# Altium schematic sheet Flash Memory.SchDoc
size B; Organization: Pyrotechnics Management Inc.; DocumentNumber: 11; SheetNumber: 11; SheetTotal: 14; PageSetup: Record=PageOptions|CenterHorizontal=True|CenterVertical=True|PrintScale=0.99|XCorrection=1.00|YCorrection=1.00|PrintKind=1|BorderSize=5000000|LeftOffset=0|BottomOffset=0|Orientation=2|PaperLength=1000|PaperWidth=1000|Scale=100|PaperSource=7|PrintQuality=-4|MediaType=1|DitherType=10|PaperKind=Tabloid (11 x 17")|PrintScaleMode=1; SCHEMATIC_SHEET_TITLE: FLASH MEMORY; PAGE_TITLE: -
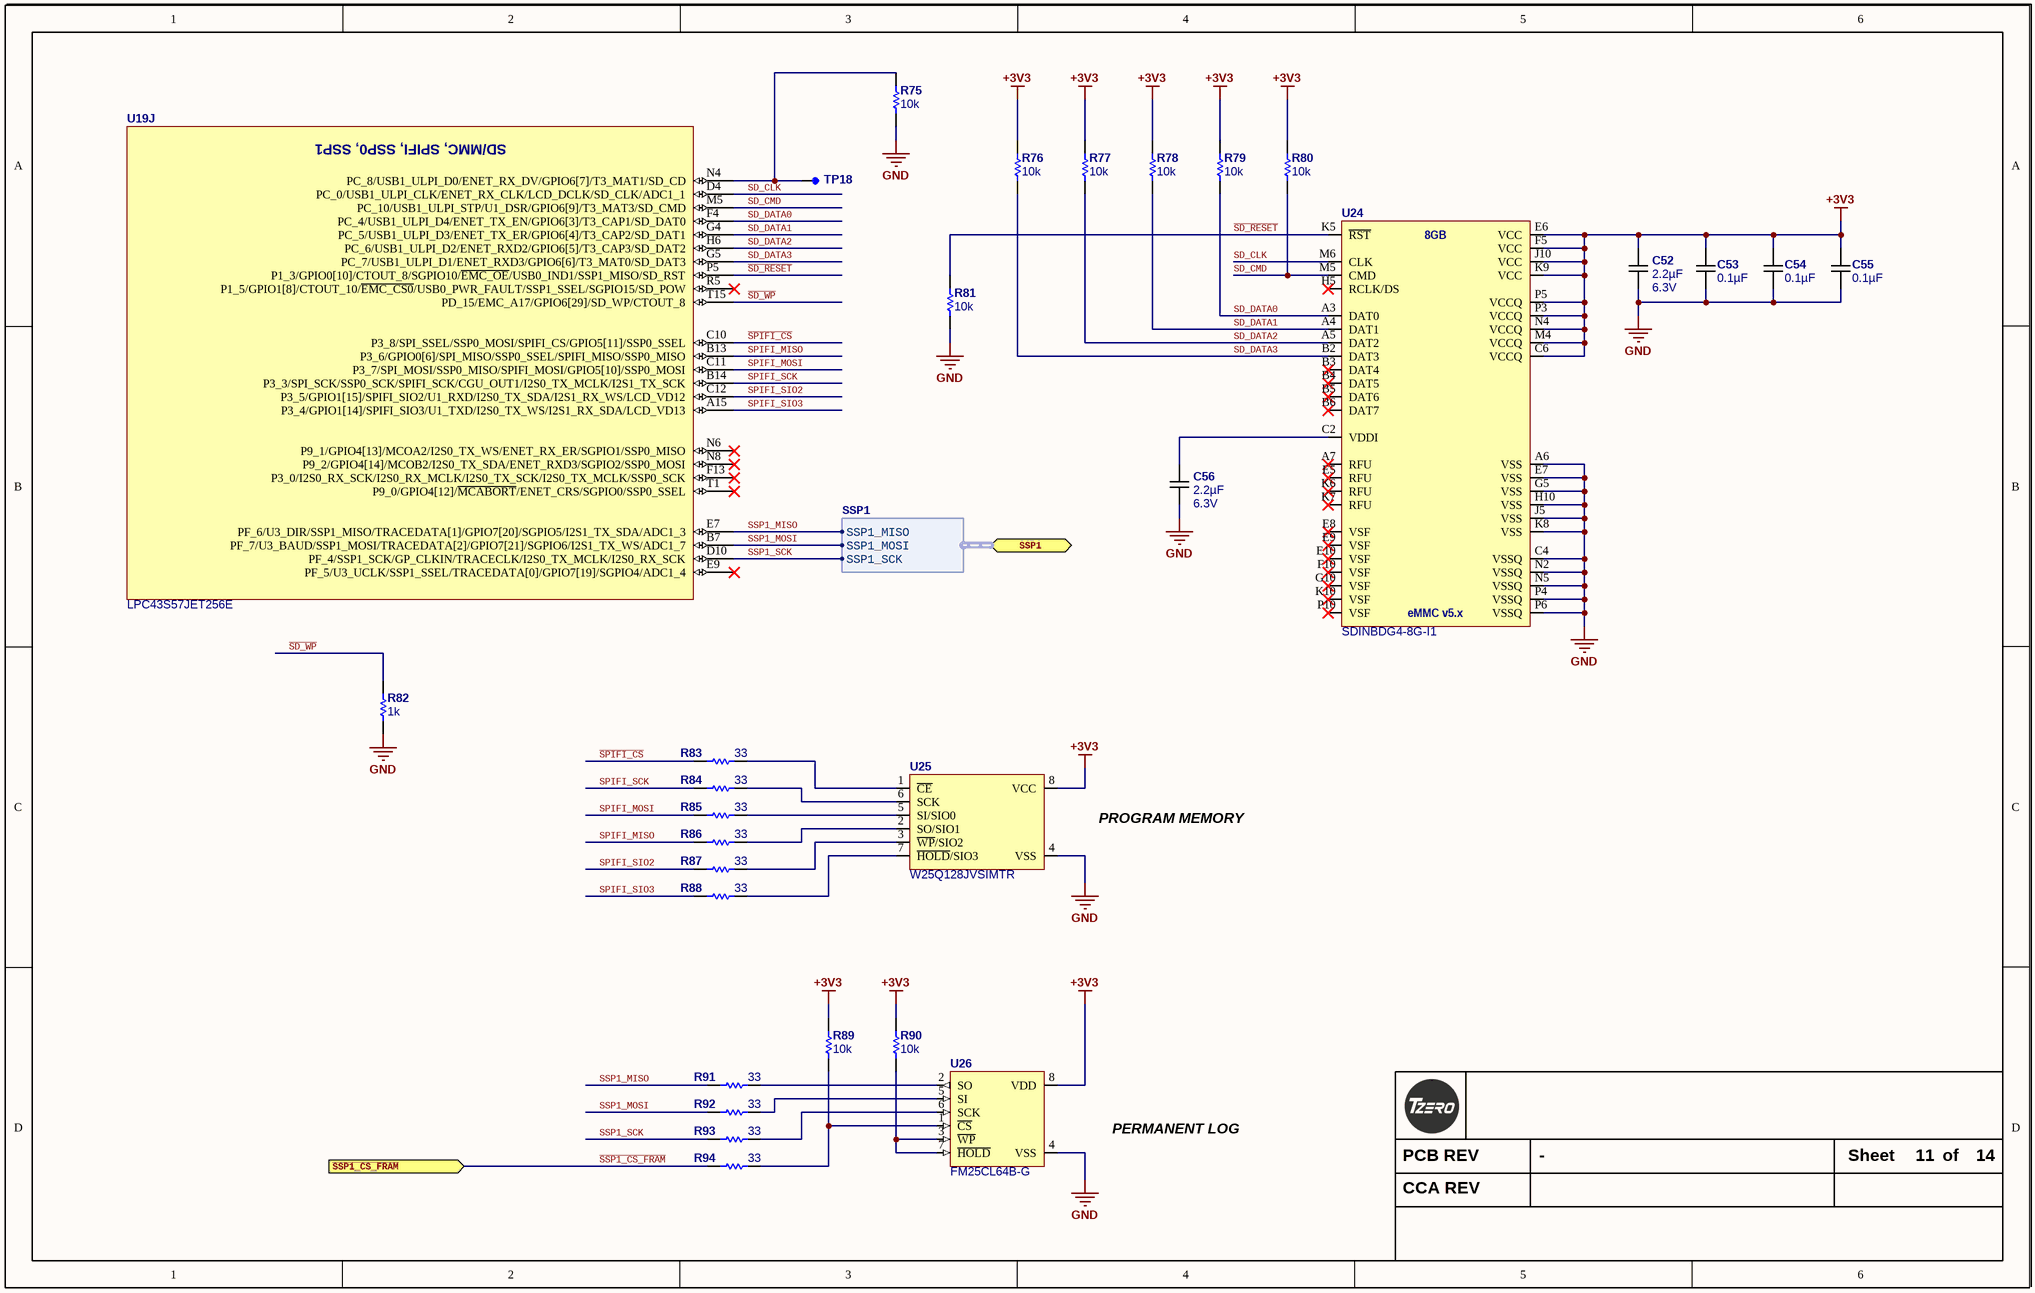
[diagram p0: Flash Memory.SchDoc]

## Parts
C52  2.2µF  Voltage - Rated: 6.3V  [C0603_0.90MM_HD]
C53  0.1µF  [C0402_0.55MM_HD]
C54  0.1µF  [C0402_0.55MM_HD]
C55  0.1µF  [C0402_0.55MM_HD]
C56  2.2µF  Voltage - Rated: 6.3V  [C0603_0.90MM_HD]
R75  10k  [R0603_0.55MM_MD]
R76  10k  [R0603_0.55MM_MD]
R77  10k  [R0603_0.55MM_MD]
R78  10k  [R0603_0.55MM_MD]
R79  10k  [R0603_0.55MM_MD]
R80  10k  [R0603_0.55MM_MD]
R81  10k  [R0603_0.55MM_MD]
R82  1k  [R0603_0.55MM_MD]
R83  33  [R0603_0.55MM_MD]
R84  33  [R0603_0.55MM_MD]
R85  33  [R0603_0.55MM_MD]
R86  33  [R0603_0.55MM_MD]
R87  33  [R0603_0.55MM_MD]
R88  33  [R0603_0.55MM_MD]
R89  10k  [R0603_0.55MM_MD]
R90  10k  [R0603_0.55MM_MD]
R91  33  [R0603_0.55MM_MD]
R92  33  [R0603_0.55MM_MD]
R93  33  [R0603_0.55MM_MD]
R94  33  [R0603_0.55MM_MD]
TP18  (no value)  [TP_SMT_25_MIL_ROUND]  (net tie, no BOM)
U19  LPC43S57JET256E  [LBGA256 16X16 1700X1700X155]  (part J of 10)
U24  SDINBDG4-8G-I1  [BGA_JDEC_EMMC_11.5x13.1x1.1_153PIN]
U25  W25Q128JVSIMTR  [SOIC-8W]
U26  FM25CL64B-G  [SOIC-8]

## Ports
SSP1 (bidir, harness SSP1), ~{SSP1_CS_FRAM} (in)

## Harnesses
SSP1: SSP1_MISO, SSP1_MOSI, SSP1_SCK

## Nets
+3V3: C52.2 C53.2 C54.2 C55.2 R76.2 R77.2 R78.2 R79.2 R80.2 R89.1 R90.2 U24.C6(VCCQ) U24.E6(VCC) U24.F5(VCC) U24.J10(VCC) U24.K9(VCC) U24.M4(VCCQ) U24.N4(VCCQ) U24.P3(VCCQ) U24.P5(VCCQ) U25.8(VCC) U26.8(VDD)
GND: C52.1 C53.1 C54.1 C55.1 C56.1 R75.1 R81.1 R82.1 U24.A6(VSS) U24.C4(VSSQ) U24.E7(VSS) U24.G5(VSS) U24.H10(VSS) U24.J5(VSS) U24.K8(VSS) U24.N2(VSSQ) U24.N5(VSSQ) U24.P4(VSSQ) U24.P6(VSSQ) U25.4(VSS) U26.4(VSS)
~{SD_RESET}: R81.2 U19.P5(P1_3/GPIO0[10]/CTOUT_8/SGPIO10/~{EMC_OE}/USB0_IND1/SSP1_MISO/SD_RST) U24.K5(~{RST})
~{SD_WP}: R82.2 U19.T15(PD_15/EMC_A17/GPIO6[29]/SD_WP/CTOUT_8)
~{SPIFI_CS}: R83.2 U19.C10(P3_8/SPI_SSEL/SSP0_MOSI/SPIFI_CS/GPIO5[11]/SSP0_SSEL)
~{SSP1_CS_FRAM}: R94.2 ; port ~{SSP1_CS_FRAM}
SD_CLK: U19.D4(PC_0/USB1_ULPI_CLK/ENET_RX_CLK/LCD_DCLK/SD_CLK/ADC1_1) U24.M6(CLK)
SD_CMD: R80.1 U19.M5(PC_10/USB1_ULPI_STP/U1_DSR/GPIO6[9]/T3_MAT3/SD_CMD) U24.M5(CMD)
SD_DATA0: R79.1 U19.F4(PC_4/USB1_ULPI_D4/ENET_TX_EN/GPIO6[3]/T3_CAP1/SD_DAT0) U24.A3(DAT0)
SD_DATA1: R78.1 U19.G4(PC_5/USB1_ULPI_D3/ENET_TX_ER/GPIO6[4]/T3_CAP2/SD_DAT1) U24.A4(DAT1)
SD_DATA2: R77.1 U19.H6(PC_6/USB1_ULPI_D2/ENET_RXD2/GPIO6[5]/T3_CAP3/SD_DAT2) U24.A5(DAT2)
SD_DATA3: R76.1 U19.G5(PC_7/USB1_ULPI_D1/ENET_RXD3/GPIO6[6]/T3_MAT0/SD_DAT3) U24.B2(DAT3)
SPIFI_MISO: R86.2 U19.B13(P3_6/GPIO0[6]/SPI_MISO/SSP0_SSEL/SPIFI_MISO/SSP0_MISO)
SPIFI_MOSI: R85.2 U19.C11(P3_7/SPI_MOSI/SSP0_MISO/SPIFI_MOSI/GPIO5[10]/SSP0_MOSI)
SPIFI_SCK: R84.2 U19.B14(P3_3/SPI_SCK/SSP0_SCK/SPIFI_SCK/CGU_OUT1/I2S0_TX_MCLK/I2S1_TX_SCK)
SPIFI_SIO2: R87.2 U19.C12(P3_5/GPIO1[15]/SPIFI_SIO2/U1_RXD/I2S0_TX_SDA/I2S1_RX_WS/LCD_VD12)
SPIFI_SIO3: R88.2 U19.A15(P3_4/GPIO1[14]/SPIFI_SIO3/U1_TXD/I2S0_TX_WS/I2S1_RX_SDA/LCD_VD13)
SSP1_MISO: R91.2 U19.E7(PF_6/U3_DIR/SSP1_MISO/TRACEDATA[1]/GPIO7[20]/SGPIO5/I2S1_TX_SDA/ADC1_3) ; port SSP1.SSP1_MISO
SSP1_MOSI: R92.2 U19.B7(PF_7/U3_BAUD/SSP1_MOSI/TRACEDATA[2]/GPIO7[21]/SGPIO6/I2S1_TX_WS/ADC1_7) ; port SSP1.SSP1_MOSI
SSP1_SCK: R93.2 U19.D10(PF_4/SSP1_SCK/GP_CLKIN/TRACECLK/I2S0_TX_MCLK/I2S0_RX_SCK) ; port SSP1.SSP1_SCK
NetC56_2: C56.2 U24.C2(VDDI)
NetR75_2: R75.2 TP18.1 U19.N4(PC_8/USB1_ULPI_D0/ENET_RX_DV/GPIO6[7]/T3_MAT1/SD_CD)
NetR83_1: R83.1 U25.1(~{CE})
NetR84_1: R84.1 U25.6(SCK)
NetR85_1: R85.1 U25.5(SI/SIO0)
NetR86_1: R86.1 U25.2(SO/SIO1)
NetR87_1: R87.1 U25.3(~{WP}/SIO2)
NetR88_1: R88.1 U25.7(~{HOLD}/SIO3)
NetR89_2: R89.2 R94.1 U26.1(~{CS})
NetR90_1: R90.1 U26.3(~{WP}) U26.7(~{HOLD})
NetR91_1: R91.1 U26.2(SO)
NetR92_1: R92.1 U26.5(SI)
NetR93_1: R93.1 U26.6(SCK)

Not connected (* = marked no-connect by the designer): U19 E9(PF_5/U3_UCLK/SSP1_SSEL/TRACEDATA[0]/GPIO7[19]/SGPIO4/ADC1_4)* F13(P3_0/I2S0_RX_SCK/I2S0_RX_MCLK/I2S0_TX_SCK/I2S0_TX_MCLK/SSP0_SCK)* N6(P9_1/GPIO4[13]/MCOA2/I2S0_TX_WS/ENET_RX_ER/SGPIO1/SSP0_MISO)* N8(P9_2/GPIO4[14]/MCOB2/I2S0_TX_SDA/ENET_RXD3/SGPIO2/SSP0_MOSI)* R5(P1_5/GPIO1[8]/CTOUT_10/~{EMC_CS0}/USB0_PWR_FAULT/SSP1_SSEL/SGPIO15/SD_POW)* T1(P9_0/GPIO4[12]/~{MCABORT}/ENET_CRS/SGPIO0/SSP0_SSEL)*; U24 A7(RFU)* B3(DAT4)* B4(DAT5)* B5(DAT6)* B6(DAT7)* E5(RFU)* E8(VSF)* E9(VSF)* E10(VSF)* F10(VSF)* G10(VSF)* H5(RCLK/DS)* K6(RFU)* K7(RFU)* K10(VSF)* P10(VSF)*

## Notes on the sheet
- PROGRAM MEMORY
- PERMANENT LOG
- PCB REV
- Sheet
- of
- CCA REV
- (in symbol LPC43S57JET256E, part J) SD/MMC, SPIFI, SSP0, SSP1
- (in symbol SDINBDG4-8G-I1) 8GB; eMMC v5.x

## Library data of the parts
C52 C56 = CGA3E1X7R0J225M080AC: CAP CER 2.2UF 6.3V X7R 0603; Manufacturer: TDK Corporation; Tolerance: ±20%; Substitution Notes: 2.2µF , 6.3V , ±20% , X7R , -55°C ~ 125°C , AEC-Q200 , 0603; Value: 2.2µF; Temperature Coefficient: X7R; Manufacturer Part Number: CGA3E1X7R0J225M080AC; ComponentLink1Description: Datasheet (Internal); ComponentLink1URL: datasheets\TDK\mlcc_automotive_general_en.pdf; ComponentLink2Description: Datasheet (External); ComponentLink2URL: https://product.tdk.com/info/en/catalog/datasheets/mlcc_automotive_general_en.pdf; Supplier 1: Digikey; Supplier Part Number 1: 445-12572-1-ND; Category: Capacitors; Operating Temperature: -55°C ~ 125°C; Ratings: AEC-Q200; Package: 0603; Thickness (Max): 0.90MM; Features: -
C53-C55 = CGA2B3X7R1E104K050BB: CAP CER 0.1UF 25V X7R 0402; Manufacturer: TDK Corporation; Tolerance: ±10%; Substitution Notes: 0.1µF , 25V , ±10% , X7R , -55°C ~ 125°C , AEC-Q200 , 0402; Value: 0.1µF; Temperature Coefficient: X7R; Manufacturer Part Number: CGA2B3X7R1E104K050BB; ComponentLink1Description: Datasheet (Internal); ComponentLink1URL: datasheets\TDK\mlcc_automotive_general_en.pdf; ComponentLink2Description: Datasheet (External); ComponentLink2URL: https://product.tdk.com/info/en/catalog/datasheets/mlcc_automotive_general_en.pdf; Supplier 1: Digikey; Supplier Part Number 1: 445-6902-1-ND; Category: Capacitors; Voltage - Rated: 25V; Operating Temperature: -55°C ~ 125°C; Ratings: AEC-Q200; Package: 0402; Thickness (Max): 0.55MM; Features: -
R75-R81 R89 R90 = ERJ-3EKF1002V: RES 10K OHM 1/10W 1% 0603 SMD; Manufacturer: Panasonic Electronic Components; Power (Watts): 0.1W- 1/10W; Temperature Coefficient: ±100ppm/°C; Package Power: 0603  (0.1W); Limiting Element Voltage: 75; Maximum Overload Voltage: 150; Maximum Working Voltage: 31.6V; Substitution Notes: 10k , ±1% , 0603 , AEC-Q200; Value: 10k; Supplier 1: Digi-Key; Supplier Part Number 1: P10.0KHCT-ND; Manufacturer Part Number: ERJ-3EKF1002V; Category: Resistors; Sort Value: 10000; Composition: Thick Film; Features: -; Tolerance: ±1%; Package: 0603 (1608 Metric); Size / Dimension: 0.063" L x 0.031" W (1.60mm x 0.80mm); Height: 0.55MM; Packaging: Cut Tape (CT); ComponentLink1URL: datasheets\Panasonic Electronic Components\AOA0000CE2.pdf; ComponentLink1Description: Internal Datasheet; ComponentLink2Description: External Datasheet; ComponentLink2URL: http://industrial.panasonic.com/www-data/pdf/AOA0000/AOA0000CE2.pdf; Resistance (Ohms): 10k; Supplier Package: 0603; Number of Terminations: 2; Sort Value Package: 603_10000; Ratings: AEC-Q200
R82 = ERJ-3EKF1001V: RES 1K OHM 1/10W 1% 0603 SMD; Manufacturer: Panasonic Electronic Components; Package Power: 0603  (0.1W); Power (Watts): 0.1W- 1/10W; Temperature Coefficient: ±100ppm/°C; Limiting Element Voltage: 75; Maximum Overload Voltage: 150; Maximum Working Voltage: 10.0V; Substitution Notes: 1k , ±1% , 0603 , AEC-Q200; Value: 1k; Manufacturer Part Number: ERJ-3EKF1001V; ComponentLink1Description: Internal Datasheet; ComponentLink1URL: datasheets\Panasonic Electronic Components\AOA0000CE2.pdf; ComponentLink2Description: External Datasheet; ComponentLink2URL: http://industrial.panasonic.com/www-data/pdf/AOA0000/AOA0000CE2.pdf; Supplier 1: Digi-Key; Supplier Part Number 1: P1.00KHCT-ND; Category: Resistors; Resistance (Ohms): 1k; Composition: Thick Film; Features: -; Tolerance: ±1%; Package: 0603 (1608 Metric); Supplier Package: 0603; Size / Dimension: 0.063" L x 0.031" W (1.60mm x 0.80mm); Height: 0.55MM; Number of Terminations: 2; Packaging: Cut Tape (CT); Sort Value: 1000; Sort Value Package: 603_1000; Ratings: AEC-Q200
R83-R88 R91-R94 = ERJ-3EKF33R0V: RES 33 OHM 1/10W 1% 0603 SMD; Manufacturer: Panasonic Electronic Components; Power (Watts): 0.1W- 1/10W; Temperature Coefficient: ±100ppm/°C; Package Power: 0603  (0.1W); Limiting Element Voltage: 75; Maximum Overload Voltage: 150; Maximum Working Voltage: 1.8V; Substitution Notes: 33 , ±1% , 0603 , AEC-Q200; Value: 33; Supplier 1: Digi-Key; Supplier Part Number 1: P33.0HCT-ND; Manufacturer Part Number: ERJ-3EKF33R0V; Category: Resistors; Sort Value: 33; Composition: Thick Film; Features: -; Tolerance: ±1%; Package: 0603 (1608 Metric); Size / Dimension: 0.063" L x 0.031" W (1.60mm x 0.80mm); Height: 0.55MM; Packaging: Cut Tape (CT); ComponentLink1URL: datasheets\Panasonic Electronic Components\AOA0000CE2.pdf; ComponentLink1Description: Internal Datasheet; ComponentLink2Description: External Datasheet; ComponentLink2URL: http://industrial.panasonic.com/www-data/pdf/AOA0000/AOA0000CE2.pdf; Resistance (Ohms): 33; Supplier Package: 0603; Number of Terminations: 2; Sort Value Package: 603_33; Ratings: AEC-Q200
TP18 = TP SMT 25MIL: Sort Value: *; Category: *; CategorySort: *
U19 = LPC43S57JET256E: ARM Microcontrollers - MCU CortexM0/4 32bit 1MB Cortex-M4/M0; Manufacturer: NXP Semiconductors; CategorySort: 600; Data RAM Size: 136 KB; Core: ARM Cortex M4/M0; Maximum Clock Frequency: 204 MHz; On-Chip ADC: Yes; Operating Supply Voltage: 2.2 V to 3.6 V; Processor Series: LPC4357; Product Status: New Technology; Value: LPC43S57JET256E; Sort Value: *; Category: Integrated Circuits; Supplier 1: Digi-Key; Supplier Part Number 1: 568-11712-ND; Manufacturer Part Number: LPC43S57JET256E; RoHS: RoHS Compliant; Stock 1: 108; Pricing 1: 1=14.40, 25=13.31, 100=12.24, 250=11.16, 500=10.43, 1000=9.57 (USD); Package: LBGA-256; Packaging: Tray; Mounting Style: SMD/SMT; Program Memory Size: 1 MB; Data Bus Width: 32 bit; Maximum Operating Temperature: + 85 C; Minimum Operating Temperature: - 40 C; Standard Pack Qty: 90; Tradename: LPC; RoHS - Mouser: Y; Minimum Order Quantity: 1; Reeling: False; ComponentLink1URL: http://www.nxp.com/documents/data_sheet/LPC4357_53_37_33.pdf; ComponentLink1Description: http://www.nxp.com/documents/data_sheet/LPC4357_53_37_33.pdf
U24 = SDINBDG4-8G-I1: eMMC eMMC seq 300/40 IOPs 7800/8000; Manufacturer: SanDisk; CategorySort: 600; Memory Size: 8 GB; Product Status: New Product; Category: Integrated Circuits; Value: SDINBDG4-8G-I1; Supplier 1: Mouser; Supplier Part Number 1: 467-SDINBDG4-8G-I1; Manufacturer Part Number: SDINBDG4-8G-I1; RoHS: RoHS Compliant; Stock 1: 2925; Pricing 1: 1=9.57, 5=9.03, 10=8.76, 25=8.65, 50=8.61, 100=8.33, 250=8.12, 500=7.95, 1000=7.86 (USD); Series: iNAND 7250; Brand: SanDisk; Moisture Sensitive: Yes; Product Type: eMMC; Standard Pack Qty: 152; Subcategory: Memory & Data Storage; Tradename: iNAND; RoHS - Mouser: Y; Minimum Order Quantity: 1; Reeling: False; ComponentLink1URL: http://www.mouser.com/datasheet/2/669/sandisk_09132017_SanDisk_COM-AUTO-INDUST_DISTI_LIN-1145140.pdf; ComponentLink1Description: http://www.mouser.com/datasheet/2/669/sandisk_09132017_SanDisk_COM-AUTO-INDUST_DISTI_LIN-1145140.pdf
U25 = W25Q128JVSIMTR: IC FLASH 128M SPI 133MHZ 8SOIC; Manufacturer: Winbond; CategorySort: 600; Category: Integrated Circuits; Value: W25Q128JVSIMTR; Supplier 1: Digi-Key; Supplier Part Number 1: W25Q128JVSIMCT-ND; Manufacturer Part Number: W25Q128JVSIMTR; Stock 1: 44076; Pricing 1: 1=1.62000, 10=1.47500, 25=1.43560, 50=1.42800, 100=1.27650, 250=1.27272, 500=1.25378, 1000=1.20000 (USD); RoHS: No; ComponentLink1URL: http://www.winbond.com/resource-files/w25q128jv_dtr%20revc%2003272018%20plus.pdf?src-supplier=Digi-Key; ComponentLink1Description: http://www.winbond.com/resource-files/w25q128jv_dtr%20revc%2003272018%20plus.pdf?src-supplier=Digi-Key
U26 = FM25CL64B-G: IC FRAM 64K SPI 20MHZ 8SOIC; Manufacturer: Cypress; CategorySort: 600; Density: 64Kb; Operating Supply Voltage: 3.3V; Packaging 1: Rail/Tube; Memory Type: RAM; Data Bus Width: 8b; Max Supply Voltage: 3.65V; Min Supply Voltage: 2.7V; Nominal Supply Current: 3mA; Access Time: 20ns; Number of Words: 8000; Category: Integrated Circuits; Value: FM25CL64B-G; Supplier 1: Digi-Key; Supplier Part Number 1: 428-3206-ND; Manufacturer Part Number: FM25CL64B-G; Stock 1: 2473; Pricing 1: 1=3.67000, 10=3.32800, 25=3.25640, 50=3.23820, 100=2.90400, 485=2.89322, 970=2.69456, 1455=2.64940 (USD); RoHS: Yes; Mount: Surface Mount; Case/Package: SOIC; Number of Pins: 8; Weight: 0.019048oz; Contact Plating: Tin; Min Operating Temperature: -40°C; Max Operating Temperature: 85°C; Interface: SPI; Frequency: 20MHz; Package Quantity: 100; Memory Size: 64Kb; Word Size: 8b; Length: 4.98mm; Height: 1.478mm; Width: 3.987mm; Radiation Hardening: No; Lead Free: Lead Free; REACH SVHC: No SVHC; ComponentLink1URL: https://datasheet.ciiva.com/26942/getdatasheetpartid-672928-26942246.pdf?src-supplier=Verical; ComponentLink1Description: https://datasheet.ciiva.com/26942/getdatasheetpartid-672928-26942246.pdf?src-supplier=Verical; ComponentLink2URL: https://datasheet.ciiva.com/12072/fm25cl64b-001-84477-0e-v-477223-12072828.pdf?src-supplier=Mouser; ComponentLink2Description: https://datasheet.ciiva.com/12072/fm25cl64b-001-84477-0e-v-477223-12072828.pdf?src-supplier=Mouser; ComponentLink3URL: https://datasheet.ciiva.com/6614/docid-47959-6614270.pdf?src-supplier=Digi-Key; ComponentLink3Description: https://datasheet.ciiva.com/6614/docid-47959-6614270.pdf?src-supplier=Digi-Key